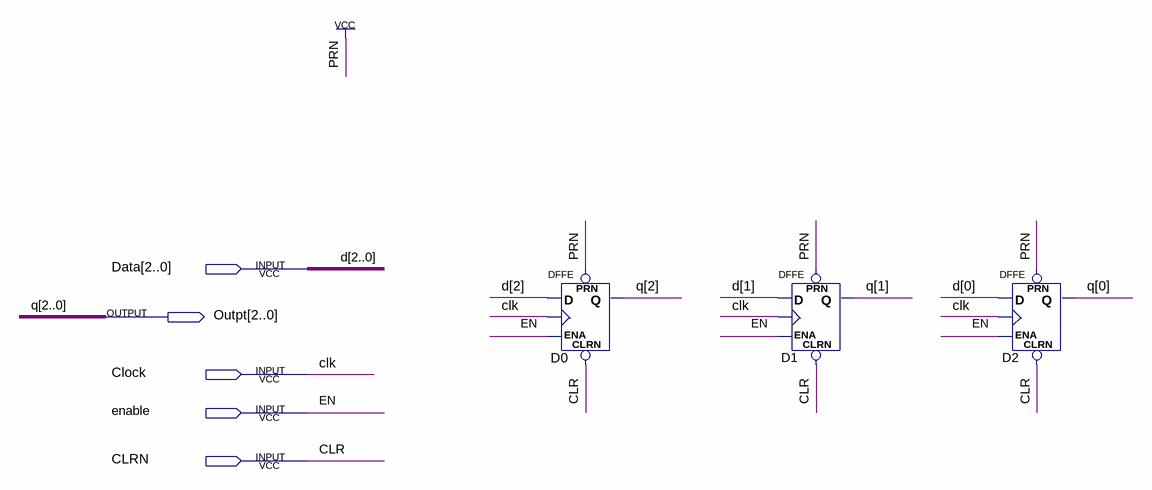
[diagram p0: schematic sheet]
// Quartus schematic Threebitreg.bdf as structural Verilog: 3 symbols, 5 pins
module Threebitreg (
  input  [2:0] Data,
  input  Clock,
  input  enable,
  input  CLRN,
  output [2:0] Outpt
);

  DFFE D0 (.PRN(1'b1), .CLRN(CLRN), .D(Data[2]), .CLK(Clock), .ENA(enable), .Q(Outpt[2]));
  DFFE D1 (.PRN(1'b1), .CLRN(CLRN), .D(Data[1]), .CLK(Clock), .ENA(enable), .Q(Outpt[1]));
  DFFE D2 (.PRN(1'b1), .CLRN(CLRN), .D(Data[0]), .CLK(Clock), .ENA(enable), .Q(Outpt[0]));

  // Other names for the same wires on the sheet: clk = Clock; CLR = CLRN; d[2:0] = Data; EN = enable; q[2:0] = Outpt
endmodule
